# EAGLE design Dash Switches - Small (EAGLE 7.5.0)
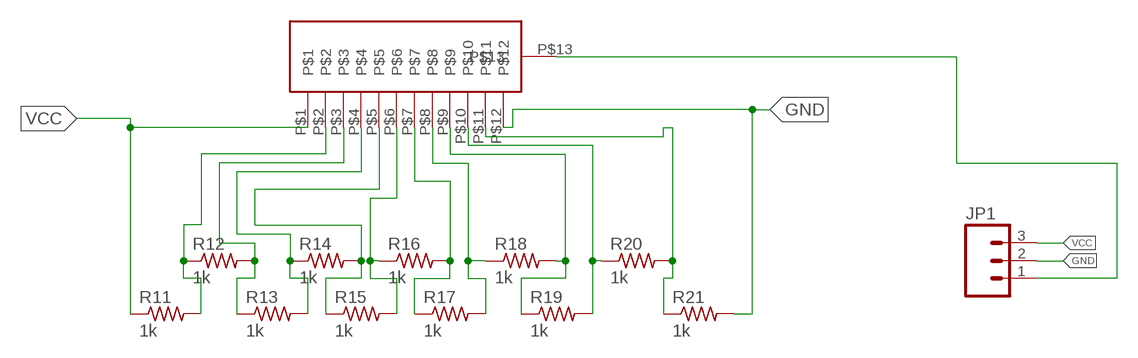
[diagram p0: schematic, sheet 1]

## Parts
JP1  M03PTH  [1X03]
R11  1k  R-US_R0603  [R0603]
R12  1k  R-US_R0603  [R0603]
R13  1k  R-US_R0603  [R0603]
R14  1k  R-US_R0603  [R0603]
R15  1k  R-US_R0603  [R0603]
R16  1k  R-US_R0603  [R0603]
R17  1k  R-US_R0603  [R0603]
R18  1k  R-US_R0603  [R0603]
R19  1k  R-US_R0603  [R0603]
R20  1k  R-US_R0603  [R0603]
R21  1k  R-US_R0603  [R0603]
U$2  ROTSWITCH  [ROTSWITCH]

## Nets
GND: JP1.2 R21.2 U$2.P$12
N$6: R11.2 R12.1 U$2.P$2
N$7: R12.2 R13.1 U$2.P$3
N$10: R13.2 R14.1 U$2.P$4
N$13: R14.2 R15.1 U$2.P$5
N$14: R17.2 R18.1 U$2.P$8
N$15: R18.2 R19.1 U$2.P$9
N$16: R15.2 R16.1 U$2.P$6
N$17: R16.2 R17.1 U$2.P$7
N$18: R19.2 R20.1 U$2.P$10
N$19: JP1.1 U$2.P$13
N$20: R20.2 R21.1 U$2.P$11
VCC: JP1.3 R11.1 U$2.P$1

## Library data of the parts
JP1 = SparkFun-Connectors:M03: Header 3 Standard 3-pin 0.1" header. Use with straight break away headers (SKU : PRT-00116), right angle break away headers (PRT-00553), swiss pins (PRT-00743), machine pins (PRT-00117), and female headers (PRT-00115). Molex polarized connector foot print use with SKU : PRT-08232 with associated crimp pins and housings.
R11-R21 = rcl:R-US_: RESISTOR, American symbol
U$2 = DashAndCAN library:ROTSWITCH

## Board
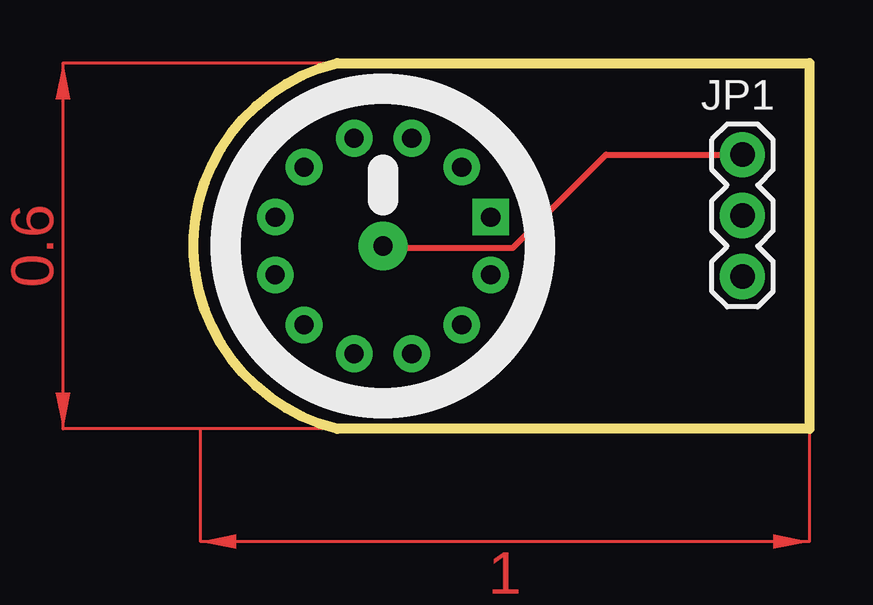
[diagram p1: board, top side]
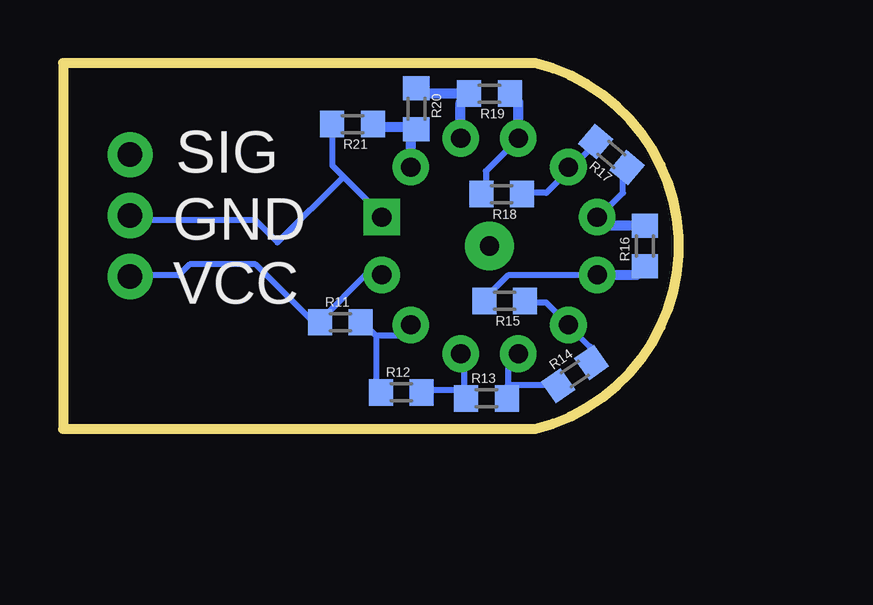
[diagram p2: board, bottom side, seen from below]

Size 25.66 x 15.24 mm. Coordinates in mm from the lower left corner, seen from the top.
Outline: 5.98,0 arc-153 5.98,15.24 25.66,15.24 25.66,0 5.98,0
Copper layers (1*16): Top 0.0356mm / dielectric 1.5011mm / Bottom 0.0356mm
Design rules "OshPark DRC": minimum track width 6mil, minimum drill 13mil, track to track 6mil, track to pad 6mil, pad to pad 6mil, via to via 6mil, smd to smd 6mil, copper to edge 15mil, drill to drill 6mil, minimum pad ring 7mil, minimum via ring 7mil, stop-mask expansion 3mil, vias tented up to drill 0mil, thermal gap 10mil

### Footprints (pad centres in the part's own frame; a part is rotated, then mirrored left to right if it is on the bottom)
1X03 = drill 1.016 pad 1.88: 1 0,0; 2 2.54,0; 3 5.08,0
R0603 = smd 1 x 1.1: 1 -0.85,0; 2 0.85,0
ROTSWITCH = drill 0.8 pad 1.524: P$1 4.49,-1.203; P$2 3.287,-3.287; P$3 1.203,-4.491; P$4 -1.203,-4.491; P$5 -3.287,-3.287; P$6 -4.491,-1.203; P$7 -4.49,1.203; P$8 -3.287,3.287; P$9 -1.203,4.49; P$10 1.203,4.49; P$11 3.287,3.287 | drill 0.8 pad 1.524 square: P$12 4.49,1.203 | drill 0.8 pad 2.032: P$13 0,0

### Placement (x,y rotation side)
JP1  22.87,11.43 270 top
R11  14.1,4.45 0 bottom
R12  11.56,1.52 0 bottom
R13  8.01,1.27 0 bottom
R14  4.33,2.29 35 bottom
R15  7.25,5.33 180 bottom
R16  1.4,7.62 90 bottom
R17  2.8,11.43 140 bottom
R18  7.37,9.78 180 bottom
R19  7.88,13.97 180 bottom
R20  10.93,13.34 270 bottom
R21  13.6,12.7 180 bottom
U$2  7.88,7.62 0 top

### Tracks (layer width: path | path; a pad name or v marks a point on that pad's centre or on a via)
GND
  Bottom 0.254: 13.98,10.52 12.38,8.91 U$2.P$12 | 13.98,10.52 14.43,10.97 14.43,12.57 R21.2 | 13.98,10.52 16.72,7.77 17.64,8.69 22.66,8.69 JP1.2
N$6
  Bottom 0.254: 12.61,3.89 12.61,1.6 R12.1 | 12.61,3.89 13.06,4.34 R11.2 | 12.61,3.89 11.46,3.89 11.23,4.12 U$2.P$2
N$7
  Bottom 0.254: 8.95,1.6 8.95,2.97 U$2.P$3 | 8.95,1.6 8.95,1.37 R13.1 8.95,1.6 | 8.95,1.6 10.55,1.6 R12.2
N$10
  Bottom 0.254: 7.12,1.83 7.12,2.74 6.89,2.97 U$2.P$4 | 7.12,1.83 7.12,1.37 R13.2 | 7.12,1.83 5.06,1.83 R14.1
N$13
  Bottom 0.254: R14.2 3.69,2.97 3.69,3.43 U$2.P$5 5.52,5.26 6.21,5.26 R15.1
N$14
  Bottom 0.254: R18.1 6.43,9.83 5.52,9.83 4.6,10.74 U$2.P$8 4.38,10.97 3.46,11.89 R17.2
N$15
  Bottom 0.254: R18.2 8.03,9.83 8.03,10.74 6.89,11.89 U$2.P$9
  Bottom 0.406: U$2.P$9 6.68,13.62 R19.1
N$16
  Bottom 0.254: R15.2 8.03,5.49 7.12,6.4 3.46,6.4 U$2.P$6
  Bottom 0.406: U$2.P$6 1.76,6.42 R16.1
N$17
  Bottom 0.254: R17.1 2.32,10.74 2.32,9.83 3.23,8.91 U$2.P$7
  Bottom 0.406: R16.2 3.04,8.47 U$2.P$7
N$18
  Bottom 0.406: U$2.P$10 9.08,13.62 R19.2 10.93,13.97 R20.1 10.59,13.97
N$19
  Top 0.254: JP1.1 17.18,11.43 13.29,7.54 8.03,7.54 U$2.P$13
N$20
  Bottom 0.254: 12.61,12.57 R21.1 | 11.01,12.57 R20.2 | 11.01,10.97 U$2.P$11
  Bottom 0.406: 11.01,12.57 11.17,12.57 | 11.17,12.57 U$2.P$11 | 11.17,12.57 12.75,12.57 R21.1
VCC
  Bottom 0.254: U$2.P$1 12.38,6.4 13.06,6.4 14.89,4.57 R11.1 15.12,4.34 17.64,6.86 20.38,6.86 20.84,6.4 22.66,6.4 JP1.3
(copper drawn outside any net)
  shapes: Top area x2

### Text on the board
bPlace: SIG | GND | VCC